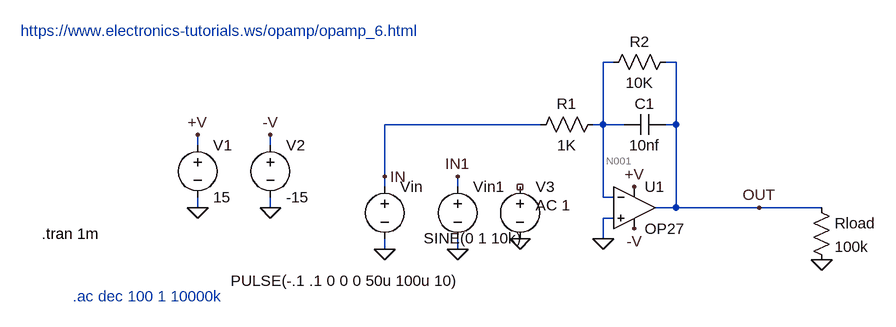
[diagram p0: schematic OP27_integrator-01.asc]
OP27_integrator-01.asc, the LTspice schematic file:
Version 4
SHEET 1 1240 700
WIRE 544 -1328 528 -1328
WIRE 640 -1328 624 -1328
WIRE 432 -1232 192 -1232
WIRE 528 -1232 528 -1328
WIRE 528 -1232 512 -1232
WIRE 560 -1232 528 -1232
WIRE 640 -1232 640 -1328
WIRE 640 -1232 624 -1232
WIRE -96 -1200 -96 -1216
WIRE 16 -1200 16 -1216
WIRE 192 -1152 192 -1232
WIRE 192 -1136 192 -1152
WIRE 304 -1136 304 -1152
WIRE 528 -1120 528 -1232
WIRE 544 -1120 528 -1120
WIRE -96 -1104 -96 -1120
WIRE 16 -1104 16 -1120
WIRE 640 -1104 640 -1232
WIRE 640 -1104 608 -1104
WIRE 768 -1104 640 -1104
WIRE 864 -1104 768 -1104
WIRE 544 -1088 528 -1088
WIRE 528 -1056 528 -1088
WIRE 192 -1040 192 -1056
WIRE 304 -1040 304 -1056
FLAG -96 -1216 +V
FLAG 192 -1040 0
FLAG 768 -1104 OUT
FLAG 192 -1152 IN
FLAG 576 -1136 +V
FLAG 16 -1216 -V
FLAG 576 -1072 -V
FLAG 864 -1024 0
FLAG 16 -1104 0
FLAG -96 -1104 0
FLAG 528 -1056 0
FLAG 304 -1040 0
FLAG 304 -1152 IN1
FLAG 400 -1056 0
SYMBOL voltage -96 -1216 R0
WINDOW 123 0 0 Left 2
WINDOW 39 0 0 Left 2
SYMATTR InstName V1
SYMATTR Value 15
SYMBOL voltage 192 -1152 R0
WINDOW 123 24 146 Left 2
WINDOW 39 24 125 Left 2
WINDOW 3 -237 160 Left 2
SYMATTR InstName Vin
SYMATTR Value PULSE(-.1 .1 0 0 0 50u 100u 10)
SYMBOL res 528 -1248 R90
WINDOW 0 0 56 VBottom 2
WINDOW 3 32 56 VTop 2
SYMATTR InstName R1
SYMATTR Value 1K
SYMBOL res 640 -1344 R90
WINDOW 0 0 56 VBottom 2
WINDOW 3 32 56 VTop 2
SYMATTR InstName R2
SYMATTR Value 10K
SYMBOL voltage 16 -1216 R0
WINDOW 123 24 146 Left 2
WINDOW 39 24 125 Left 2
SYMATTR InstName V2
SYMATTR Value -15
SYMBOL res 848 -1120 R0
SYMATTR InstName Rload
SYMATTR Value 100k
SYMBOL opamps\\OP27 576 -1168 R0
SYMATTR InstName U1
SYMBOL cap 624 -1248 R90
WINDOW 0 0 32 VBottom 2
WINDOW 3 32 32 VTop 2
SYMATTR InstName C1
SYMATTR Value 10nf
SYMATTR SpiceLine V=100 Irms=0 Rser=0 Lser=0 mfg="Murata" pn="GCM21BR72A683KA37" type="X7R"
SYMBOL voltage 304 -1152 R0
WINDOW 123 24 146 Left 2
WINDOW 39 24 125 Left 2
WINDOW 3 -52 95 Left 2
SYMATTR InstName Vin1
SYMATTR Value SINE(0 1 10k)
SYMBOL voltage 400 -1152 R0
WINDOW 123 24 44 Left 2
WINDOW 39 0 0 Left 0
SYMATTR InstName V3
SYMATTR Value ""
SYMATTR Value2 AC 1
TEXT -288 -968 Left 2 ;.ac dec 100 1 10000k
TEXT -336 -1064 Left 2 !.tran 1m
TEXT -368 -1376 Left 2 ;https://www.electronics-tutorials.ws/opamp/opamp_6.html

The netlist it stands for:
* OP27_integrator-01.asc
V1 +V 0 15
Vin IN 0 PULSE(-.1 .1 0 0 0 50u 100u 10)
R1 N001 IN 1K
R2 OUT N001 10K
V2 -V 0 -15
Rload OUT 0 100k
XU1 0 N001 +V -V OUT OP27  ; pins In+ In- V+ V- OUT
C1 OUT N001 10nf V=100 Irms=0 Rser=0 Lser=0 mfg="Murata" pn="GCM21BR72A683KA37" type="X7R"
Vin1 IN1 0 SINE(0 1 10k)
V3 NC_01 0 AC 1
* .ac dec 100 1 10000k
.tran 1m
* https://www.electronics-tutorials.ws/opamp/opamp_6.html
.lib ADI.lib
.backanno
.end

* Results of the author's LTspice run, read from the files saved beside the schematic
* Operating Point, zero values left out:
*   V(+v) = 15 V
*   V(in) = -100 mV
*   V(n001) = -427.8 nV
*   V(out) = 1 V
*   V(-v) = -15 V
*   I(R1) = 100 µA
*   I(R2) = 100 µA
*   I(Rload) = 10 µA
*   I(V1) = -3.025 mA
*   I(Vin) = 100 µA
*   I(V2) = 2.915 mA
*   Ix(u1:3) = 3.025 mA
*   Ix(u1:4) = -2.915 mA
*   Ix(u1:5) = -110 µA
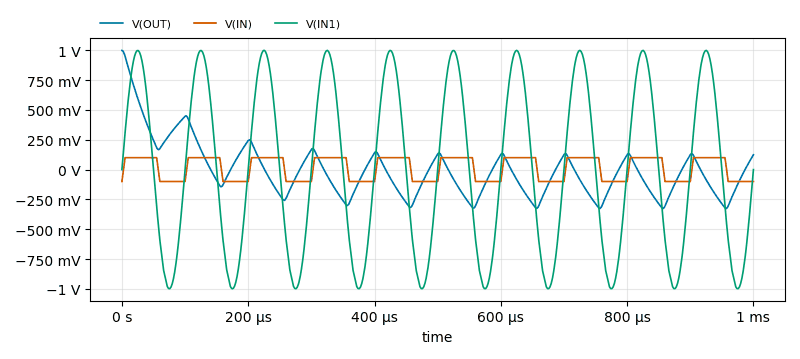
[diagram p1: Transient Analysis of OP27_integrator-01.asc, plotted from the saved traces]
* Transient Analysis, 1 run:
*   V(OUT): min -326.3 mV, max 1 V, average -12.26 mV, rms 228.8 mV, last 124.3 mV
*   V(IN): min -100 mV, max 100 mV, average 10 mV, rms 96.89 mV, last -100 mV
*   V(IN1): min -999.7 mV, max 999.9 mV, average 776.7 µV, rms 706.6 mV, last 0 V